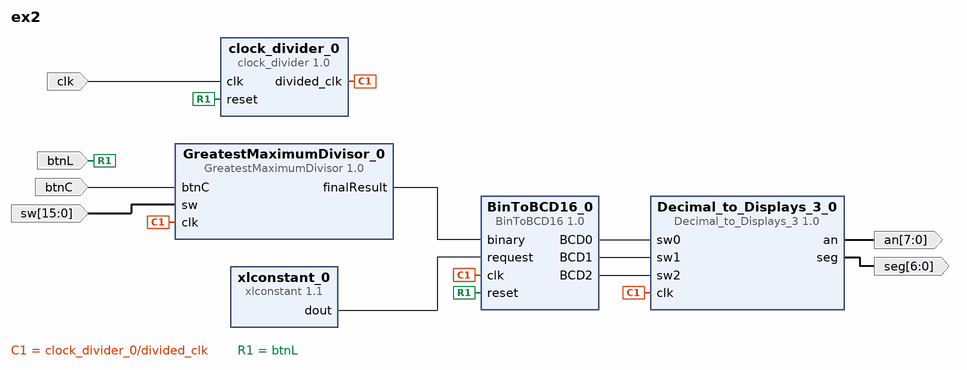
[diagram p0: block diagram of the top level]
# Vivado block design ex2, xc7a100tcsg324-1, Vivado 2016.4
create_bd_design ex2

create_bd_port -dir I -type clk clk
set_property -dict {CONFIG.FREQ_HZ 100000000} [get_bd_ports clk]
create_bd_port -dir I btnC
create_bd_port -dir I -type rst btnL
create_bd_port -dir O -from 7 -to 0 an
create_bd_port -dir O -from 6 -to 0 seg
create_bd_port -dir I -from 15 -to 0 sw

create_bd_cell -type ip -vlnv xilinx.com:user:clock_divider:1.0 clock_divider_0
create_bd_cell -type ip -vlnv xilinx.com:user:BinToBCD16:1.0 BinToBCD16_0
create_bd_cell -type ip -vlnv xilinx.com:ip:xlconstant:1.1 xlconstant_0
create_bd_cell -type ip -vlnv xilinx.com:user:GreatestMaximumDivisor:1.0 GreatestMaximumDivisor_0
create_bd_cell -type ip -vlnv xilinx.com:user:Decimal_to_Displays_3:1.0 Decimal_to_Displays_3_0

# ---- connections ----

connect_bd_net [get_bd_ports clk] [get_bd_pins clock_divider_0/clk]
connect_bd_net [get_bd_pins clock_divider_0/divided_clk] \
  [get_bd_pins BinToBCD16_0/clk] [get_bd_pins GreatestMaximumDivisor_0/clk] [get_bd_pins Decimal_to_Displays_3_0/clk]
connect_bd_net [get_bd_ports btnL] [get_bd_pins BinToBCD16_0/reset] [get_bd_pins clock_divider_0/reset]
connect_bd_net [get_bd_pins xlconstant_0/dout] [get_bd_pins BinToBCD16_0/request]
connect_bd_net [get_bd_ports btnC] [get_bd_pins GreatestMaximumDivisor_0/btnC]
connect_bd_net [get_bd_ports sw] [get_bd_pins GreatestMaximumDivisor_0/sw]
connect_bd_net [get_bd_pins GreatestMaximumDivisor_0/finalResult] [get_bd_pins BinToBCD16_0/binary]
connect_bd_net [get_bd_pins BinToBCD16_0/BCD0] [get_bd_pins Decimal_to_Displays_3_0/sw0]
connect_bd_net [get_bd_pins BinToBCD16_0/BCD1] [get_bd_pins Decimal_to_Displays_3_0/sw1]
connect_bd_net [get_bd_pins BinToBCD16_0/BCD2] [get_bd_pins Decimal_to_Displays_3_0/sw2]
connect_bd_net [get_bd_pins Decimal_to_Displays_3_0/seg] [get_bd_ports seg]
connect_bd_net [get_bd_pins Decimal_to_Displays_3_0/an] [get_bd_ports an]

validate_bd_design
save_bd_design
